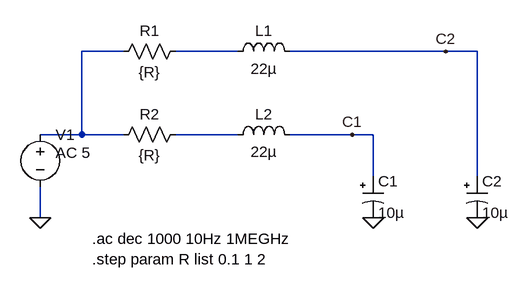
[diagram p0: schematic power.asc]
power.asc, the LTspice schematic file:
Version 4
SHEET 1 880 680
WIRE 64 -272 0 -272
WIRE 240 -272 144 -272
WIRE 560 -272 320 -272
WIRE 608 -272 560 -272
WIRE 0 -144 0 -272
WIRE 0 -144 -64 -144
WIRE 64 -144 0 -144
WIRE 240 -144 144 -144
WIRE 416 -144 320 -144
WIRE 448 -144 416 -144
WIRE 448 -80 448 -144
WIRE 608 -80 608 -272
WIRE -64 -16 -64 -64
FLAG -64 -16 0
FLAG 448 -16 0
FLAG 608 -16 0
FLAG 416 -144 C1
FLAG 560 -272 C2
SYMBOL res 160 -288 R90
WINDOW 0 0 56 VBottom 2
WINDOW 3 32 56 VTop 2
SYMATTR InstName R1
SYMATTR Value {R}
SYMBOL res 160 -160 R90
WINDOW 0 0 56 VBottom 2
WINDOW 3 32 56 VTop 2
SYMATTR InstName R2
SYMATTR Value {R}
SYMBOL ind 224 -256 R270
WINDOW 0 32 56 VTop 2
WINDOW 3 5 56 VBottom 2
SYMATTR InstName L1
SYMATTR Value 22µ
SYMATTR SpiceLine Ipk=1 Rser=0.07224 Rpar=2072.4 Cpar=0 mfg="Coilcraft" pn="DT3316P-223"
SYMBOL ind 224 -128 R270
WINDOW 0 32 56 VTop 2
WINDOW 3 5 56 VBottom 2
SYMATTR InstName L2
SYMATTR Value 22µ
SYMATTR SpiceLine Ipk=1 Rser=0.07224 Rpar=2072.4 Cpar=0 mfg="Coilcraft" pn="DT3316P-223"
SYMBOL polcap 432 -80 R0
WINDOW 3 24 56 Left 2
SYMATTR InstName C1
SYMATTR Value 10µ
SYMATTR Description Capacitor
SYMATTR Type cap
SYMATTR SpiceLine V=16 Irms=1.12694 Rser=0.1 Lser=0 mfg="KEMET" pn="T521B106M016ATE100" type="Tantalum"
SYMBOL polcap 592 -80 R0
WINDOW 3 24 56 Left 2
SYMATTR InstName C2
SYMATTR Value 10µ
SYMATTR Description Capacitor
SYMATTR Type cap
SYMATTR SpiceLine V=16 Irms=35m Rser=2.8 Lser=0 mfg="Nichicon" pn="UPR1C100MAH" type="Al electrolytic"
SYMBOL voltage -64 -160 R0
WINDOW 123 24 44 Left 2
WINDOW 39 0 0 Left 0
SYMATTR InstName V1
SYMATTR Value ""
SYMATTR Value2 AC 5
TEXT 16 16 Left 2 !.ac dec 1000 10Hz 1MEGHz
TEXT 16 48 Left 2 !.step param R list 0.1 1 2

The netlist it stands for:
* power.asc
R1 N002 N001 {R}
R2 N003 N001 {R}
L1 N002 C2 22µ Ipk=1 Rser=0.07224 Rpar=2072.4 Cpar=0 mfg="Coilcraft" pn="DT3316P-223"
L2 N003 C1 22µ Ipk=1 Rser=0.07224 Rpar=2072.4 Cpar=0 mfg="Coilcraft" pn="DT3316P-223"
C1 C1 0 10µ V=16 Irms=1.12694 Rser=0.1 Lser=0 mfg="KEMET" pn="T521B106M016ATE100" type="Tantalum"
C2 C2 0 10µ V=16 Irms=35m Rser=2.8 Lser=0 mfg="Nichicon" pn="UPR1C100MAH" type="Al electrolytic"
V1 N001 0 AC 5
.ac dec 1000 10Hz 1MEGHz
.step param R list 0.1 1 2
.backanno
.end